# EAGLE design Si4356-V1 (EAGLE 7.2.0)
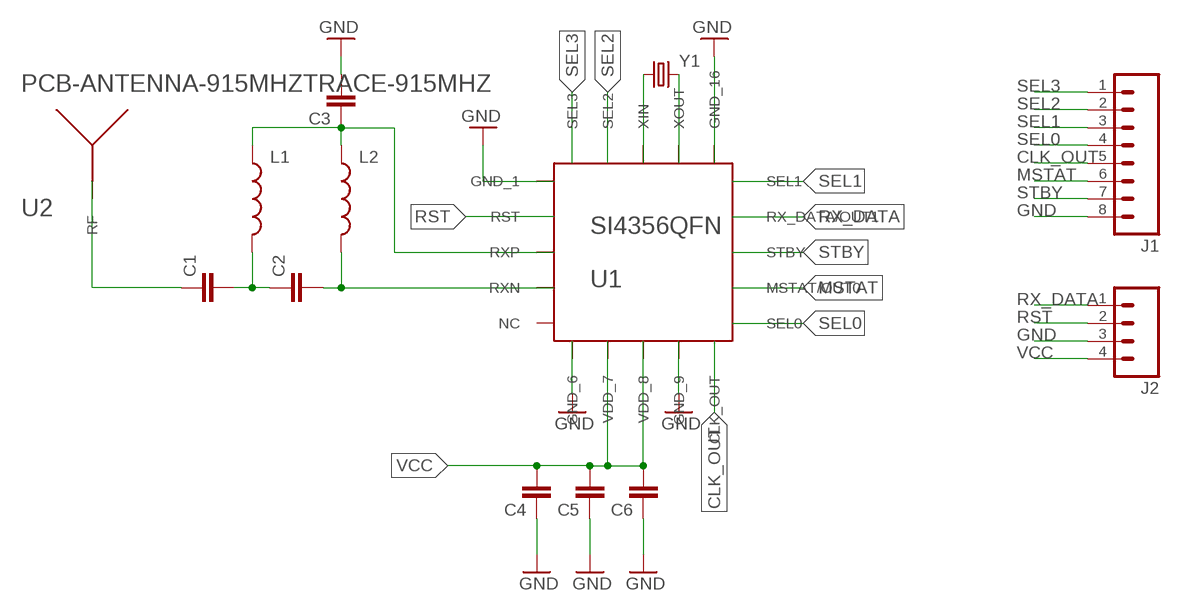
[diagram p0: schematic, sheet 1]

## Parts
C1  CAP0603-CAP  [0603-CAP]
C2  CAP0603-CAP  [0603-CAP]
C3  CAP0603-CAP  [0603-CAP]
C4  CAP0603-CAP  [0603-CAP]
C5  CAP0603-CAP  [0603-CAP]
C6  CAP0603-CAP  [0603-CAP]
J1  M08  [1X08_ROUND]
J2  M04PTH  [1X04]
L1  INDUCTOR0805  [0805]
L2  INDUCTOR0805  [0805]
U1  SI4356QFN  [QFN20-3X3MM]
U2  PCB-ANTENNA-915MHZTRACE-915MHZ  [PCB-ANTENNA-915MHZ-16.8MM]
Y1  CRYSTALHC49US  [HC49US]

## Nets
CLK_OUT: J1.5 U1.10(CLK_OUT)
GND: C3.2 C4.1 C5.1 C6.1 J1.8 J2.3 U1.1(GND_1) U1.6(GND_6) U1.9(GND_9) U1.16(GND_16)
MSTAT: J1.6 U1.12(MSTAT/OUT0)
N$1: C1.2 C2.1 L1.2
N$2: U1.18(XIN) Y1.1
N$3: U1.17(XOUT) Y1.2
N$5: C1.1 U2.1(RF)
RST: J2.2 U1.2(RST)
RX_DATA: J2.1 U1.14(RX_DATA/OUT1)
RXN: C2.2 L2.2 U1.4(RXN)
RXP: C3.1 L1.1 L2.1 U1.3(RXP)
SEL0: J1.4 U1.11(SEL0)
SEL1: J1.3 U1.15(SEL1)
SEL2: J1.2 U1.19(SEL2)
SEL3: J1.1 U1.20(SEL3)
STBY: J1.7 U1.13(STBY)
VCC: C4.2 C5.2 C6.2 J2.4 U1.7(VDD_7) U1.8(VDD_8)
Unconnected: U1.5(NC)

## Library data of the parts
C1-C6 = SparkFun-Capacitors:CAP: Capacitor Standard 0603 ceramic capacitor, and 0.1" leaded capacitor.
J1 = SparkFun-Connectors:M08: Header 8 Standard 8-pin 0.1" header. Use with straight break away headers (SKU : PRT-00116), right angle break away headers (PRT-00553), swiss pins (PRT-00743), machine pins (PRT-00117), and female headers (PRT-00115).; PROD_ID: CONN-08437
J2 = SparkFun-Connectors:M04: Header 4 Standard 4-pin 0.1" header. Use with straight break away headers (SKU : PRT-00116), right angle break away headers (PRT-00553), swiss pins (PRT-00743), machine pins (PRT-00117), and female headers (PRT-00115). Molex polarized connector foot print use with SKU : PRT-08231 with associated crimp pins and housings. 1MM SMD Version SKU: PRT-10208; PROD_ID: CONN-09696
L1 L2 = SparkFun-Passives:INDUCTOR: Inductors Basic Inductor/Choke - 0603 and 1206. Footprints are not proven and vary greatly between part numbers. INDUCTOR POWER 3.3UH 4.0A SMD 0.197" L x 0.197" W x 0.177" H (5.00mm x 5.00mm x 4.50mm)
U1 = Ilan:SI4356: Si4356 STANDALONE SUB-GHZ RECEIVER
U2 = Ilan:PCB-ANTENNA-915MHZ
Y1 = SparkFun-FreqCtrl:CRYSTAL: Various standard crystals. Proven footprints.

## Board
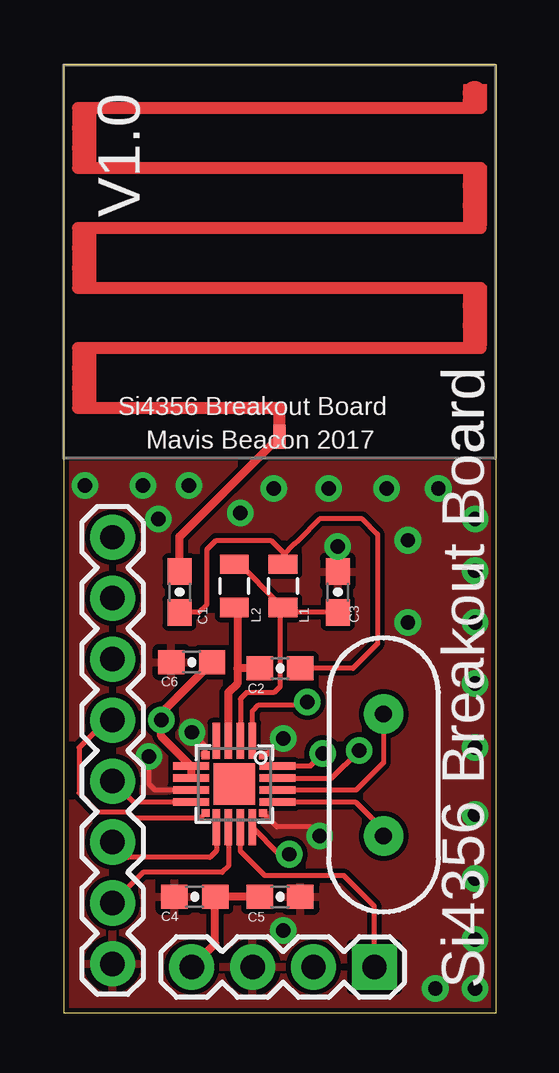
[diagram p1: board, top side]
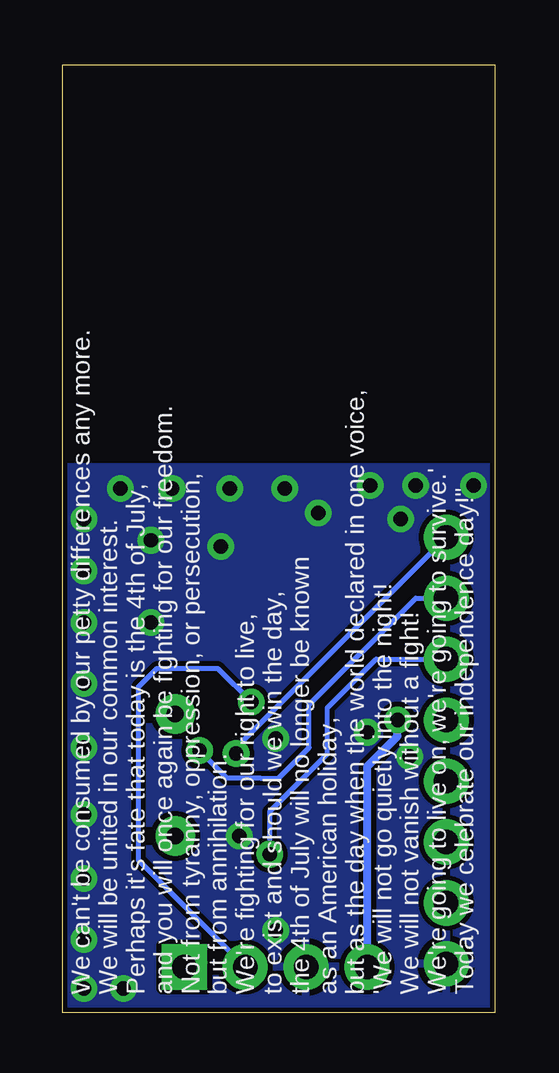
[diagram p2: board, bottom side, seen from below]

Size 18.03 x 39.5 mm. Coordinates in mm from the lower left corner, seen from the top.
Outline: 0,0 18.03,0 18.03,39.5 0,39.5 0,0
Copper layers (1*16): Top 0.035mm / dielectric 1.5mm / Bottom 0.035mm
Design rules "SparkFun": minimum track width 8mil, minimum drill 20mil, track to track 8mil, track to pad 8mil, pad to pad 8mil, via to via 8mil, smd to smd 8mil, copper to edge 8mil, drill to drill 8mil, minimum pad ring 12mil, minimum via ring 10mil, stop-mask expansion 4mil, vias tented up to drill 20mil, thermal gap 10mil

### Footprints (pad centres in the part's own frame; a part is rotated, then mirrored left to right if it is on the bottom)
0603-CAP = smd 1.1 x 1: 1 -0.85,0; 2 0.85,0
1X08_ROUND = drill 1.016 pad 1.88: 1 0,0; 2 2.54,0; 3 5.08,0; 4 7.62,0; 5 10.16,0; 6 12.7,0; 7 15.24,0; 8 17.78,0
1X04 = drill 1.016 pad 1.88 square: 1 0,0 | drill 1.016 pad 1.88: 2 2.54,0; 3 5.08,0; 4 7.62,0
0805 = smd 0.8 x 1.2: 1 -0.9,0; 2 0.9,0
QFN20-3X3MM = smd 0.32 x 0.32: 1 -1.2,1.2; 6 -1.2,-1.2; 11 1.2,-1.2; 16 1.2,1.2 | smd 1.5 x 0.32: 2 -1.8,0.75; 3 -1.8,0.25; 4 -1.8,-0.25; 5 -1.8,-0.75; 12 1.8,-0.75; 13 1.8,-0.25; 14 1.8,0.25; 15 1.8,0.75 | smd 0.32 x 1.5: 7 -0.75,-1.8; 8 -0.25,-1.8; 9 0.25,-1.8; 10 0.75,-1.8; 17 0.75,1.8; 18 0.25,1.8; 19 -0.25,1.8; 20 -0.75,1.8 | smd 1.72 x 1.72: GND 0,0
PCB-ANTENNA-915MHZ-16.8MM = smd 0.5 x 1: 1 0.1,-7.5
HC49US = drill 0.7 pad 1.651: 1 -2.54,0; 2 2.54,0

### Placement (x,y rotation side)
C1  4.83,17.53 270 top
C2  9.02,14.35 180 top
C3  11.43,17.53 90 top
C4  5.46,4.83 0 top
C5  9.02,4.83 180 top
C6  5.33,14.61 0 top
J1  2.03,19.81 270 top
J2  12.95,1.91 180 top
L1  9.14,17.78 90 top
L2  7.11,17.78 270 top
U1  7.11,9.53 270 top
U2  8.89,31.5 0 top
Y1  13.34,9.91 270 top

### Tracks (layer width: path | path; a pad name or v marks a point on that pad's centre or on a via)
CLK_OUT
  Top 0.203: U1.10 2.91,8.78 J1.5
GND  (via drill 0.6)
  Top 0.203: C3.2 v11.43,19.43 | v10.67,7.37 10.29,7.75 8.89,7.75 U1.16 | U1.1 8.44,10.72 v9.14,11.43 | U1.9 3.81,9.28 3.56,9.53 v3.56,10.67 | U1.6 5.91,11.11 v5.33,11.68
  Bottom 0.203: v11.43,19.43 11.56,19.56
  other vias: 9.14,3.43 0.89,21.97 3.3,21.97 8.76,21.84 11.05,21.84 13.46,21.84 15.62,21.84 17.14,20.57 17.14,18.41 17.14,16.26 17.14,13.72 17.14,11.05 17.14,8.26 17.14,5.59 17.14,3.05 17.14,1.02 15.49,1.02 5.21,21.97 7.37,20.83 3.94,20.57 14.35,19.68 14.35,16.26
  pour Top: 0,22.86 18.03,22.86 18.03,-0.13 0,-0.13
  pour Bottom: 0,22.73 17.91,22.73 18.03,22.61 18.03,0 0,0
MSTAT
  Top 0.203: U1.12 6.36,6.74 6.1,6.48 2.67,6.48 J1.6
N$1
  Top 0.203: C2.1 12.06,14.35 13.08,15.37 13.08,19.94 12.45,20.57 10.67,20.57 9.78,19.68 9.65,19.56 9.14,19.05 L1.2 9.14,19.18 8.64,19.68 6.35,19.68 5.97,19.3 5.97,17.02 5.63,16.68 C1.2
N$2
  Top 0.203: Y1.1 13.34,10.41 12.19,9.27 U1.18
N$3
  Top 0.203: Y1.2 13.34,7.62 12.19,8.76 8.92,8.76 U1.17
N$5
  Top 0.33: C1.1 4.83,19.83 U2.1
RST  (via drill 0.6)
  Top 0.203: U1.2 7.86,12.56 8.13,12.83 10.03,12.83 v10.16,12.95
  Bottom 0.203: J2.2 14.86,6.35 14.86,13.59 14.1,14.35 11.56,14.35 v10.16,12.95
RX_DATA
  Top 0.203: J2.1 12.95,4.45 11.68,5.71 8.38,5.71 7.37,6.73 U1.14
RXN
  Top 0.33: L2.2 7.24,16.75 7.24,14.35 | 7.24,14.35 7.24,13.72 6.86,13.34 U1.4 | C2.2 7.24,14.35
RXP
  Top 0.203: L2.1 7.36,18.68 8.13,17.91 8.13,17.9 L1.1 | C3.1 9.35,16.68 L1.1 | U1.3 7.37,13.08 7.62,13.34 8.76,13.34 9.02,13.59 9.02,16.75 L1.1
SEL0
  Top 0.203: J1.4 1.78,12.19 0.64,11.05 0.64,9.14 1.4,8.38 2.67,8.38 2.92,8.13 5.71,8.13 U1.11
SEL1  (via drill 0.6)
  Top 0.203: U1.15 8.98,6.6 v9.4,6.6
  Bottom 0.203: v9.4,6.6 9.4,8.38 6.99,10.79 6.99,12.7 4.95,14.73 J1.3
SEL2  (via drill 0.6)
  Top 0.203: U1.19 11.17,9.78 v12.32,10.92
  Bottom 0.203: J1.2 3.3,17.27 7.75,12.83 7.75,11.05 9.02,9.78 9.78,9.78 11.18,9.78 v12.32,10.92
SEL3  (via drill 0.6)
  Top 0.203: U1.20 10.28,10.28 v10.79,10.79
  Bottom 0.203: J1.1 10.79,11.05 v10.79,10.79
STBY
  Top 0.203: U1.13 6.86,6.1 6.6,5.84 3.3,5.84 J1.7
VCC  (via drill 0.6)
  Top 0.203: U1.8
  Top 0.33: U1.8 U1.7 4.06,11.52 v4.06,12.19 4.06,12.48 C6.2 | C5.2 C4.2 6.31,2.88 J2.4
  Bottom 0.33: J2.4 5.31,1.93 U1.7 4.06,11.52 v4.06,12.19

### Text on the board
tPlace: V1.0 | Si4356 Breakout Board | Mavis Beacon 2017 | Si4356 Breakout Board
bPlace: We can't be consumed by our petty differences any more. / We will be united in our common interest. / Perhaps it's fate that today is the 4th of July, / and you will once again be fighting for our freedom. / Not from tyranny, oppression, or persecution, / but from annihilation. / We're fighting for our right to live, / to exist and should we win the day, / the 4th of July will no longer be known / as an American holiday, / but as the day when the world declared in one voice, / 'We will not go quietly into the night! / We will not vanish without a fight! / We're going to live on, we're going to survive.' / Today we celebrate our independence day!"